# EAGLE design battery timer (EAGLE 6.5.0)
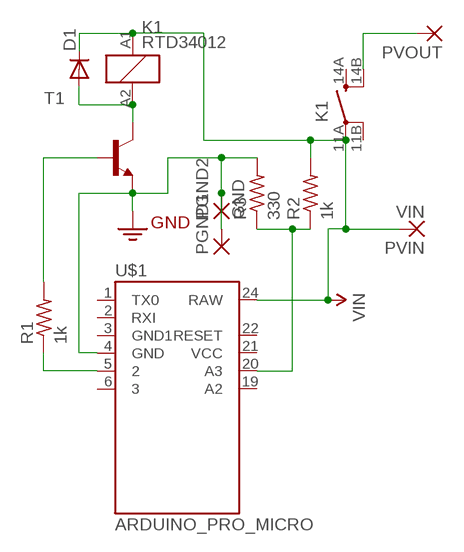
[diagram p0: schematic, sheet 1]

## Parts
D1  DIODE-DO-214AC  [DO-214AC]
K1  RTD34012  [RT-N/O16A5]
PGND1  SMD5  [SMD2,54-5,08]
PGND2  GND  SMD5  [SMD2,54-5,08]
PVIN  VIN  SMD5  [SMD2,54-5,08]
PVOUT  SMD5  [SMD2,54-5,08]
R1  1k  R-US_R1206  [R1206]
R2  1k  R-US_R1206  [R1206]
R3  330  R-US_R1206  [R1206]
T1  MMBT4401LT1-NPN-SOT23-BEC  [SOT23-BEC]
U$1  ARDUINO_PRO_MICRO  [ARDUINO_PRO_MICRO]

## Nets
3.3V: PGND1.1(P) PGND2.1(P) R3.2 T1.E U$1.4(GND) ; supply symbol labelled GND2
N$1: R2.1 R3.1 U$1.20(A3)
N$2: R1.1 U$1.5
N$3: D1.A K1.A2 T1.C
N$4: R1.2 T1.B
PVOUT [12v]: K1.14B(2:SB) PVOUT.1(P)
VIN: D1.C K1.11A(2:PA) K1.A1 PVIN.1(P) R2.2 U$1.24(RAW)
Unconnected: K1.11B(2:PB) K1.14A(2:SA) U$1.1(TX0) U$1.2(RXI) U$1.3(GND1) U$1.6 U$1.19(A2) U$1.21(VCC) U$1.22(RESET)

## Library data of the parts
D1 = diode:DIODE-: DIODE
K1 = relay:RTD3*: Power PCB Relay SCHRACK 1 pole 12 / 16 A, DC- or AC-coil Source: http://www.schrack.com/.. 5819.pdf; MF: TYCO ELECTRONICS; MPN: RTD34012F; OC_FARNELL: unknown; OC_NEWARK: 36K3470
PGND1 PGND2 PVIN PVOUT = wirepad:SMD5: SMD PAD
R1-R3 = resistor:R-US_: RESISTOR, American symbol
T1 = transistor:*-NPN-: NPN Transistror BF959 corrected 2008.03.06
U$1 = SparkFun-Boards:ARDUINO_PRO_MICRO

## Net classes
0 default: width 0.508 mm, drill 0.508 mm, clearance 0.508 mm
1 12v: width 2.54 mm, drill 2.54 mm, clearance 0.635 mm

## Board
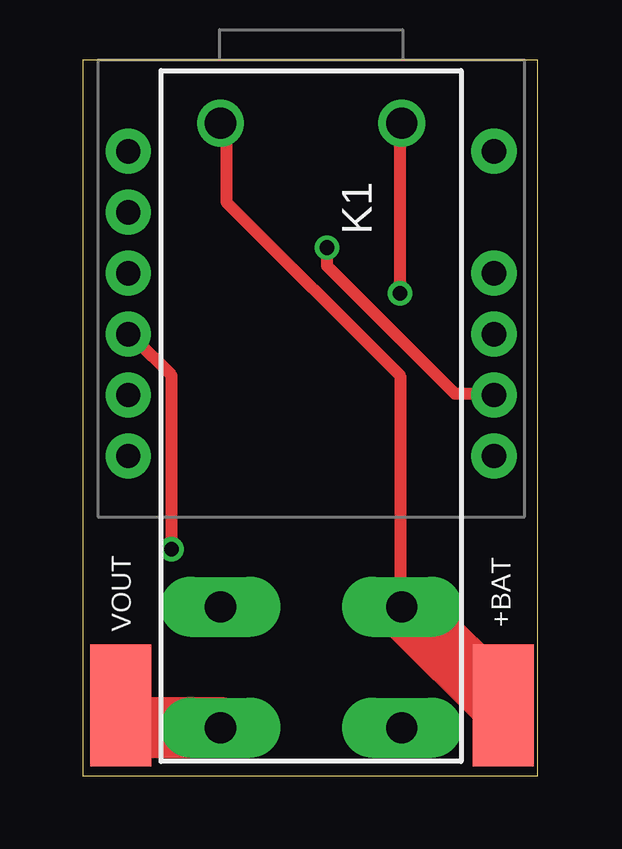
[diagram p1: board, top side]
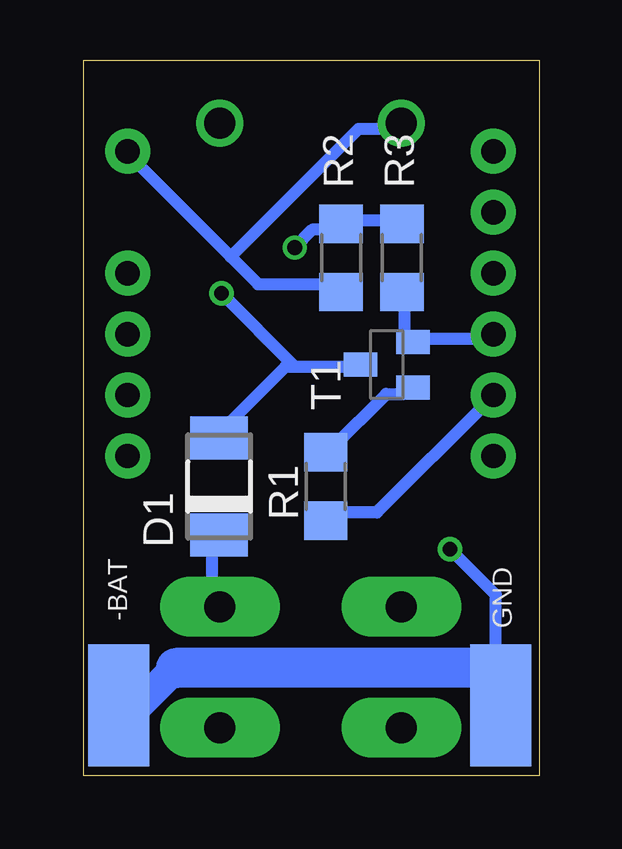
[diagram p2: board, bottom side, seen from below]

Size 18.97 x 29.84 mm. Coordinates in mm from the lower left corner, seen from the top.
Outline: 0,0 18.97,0 18.97,29.84 0,29.84 0,0
Copper layers (1*16): Top 0.035mm / dielectric 1.5mm / Bottom 0.035mm
Design rules "default": minimum track width 10mil, minimum drill 24mil, track to track 8mil, track to pad 8mil, pad to pad 8mil, via to via 8mil, smd to smd 8mil, copper to edge 40mil, drill to drill 8mil, minimum pad ring 10mil, minimum via ring 8mil, stop-mask expansion 4mil, vias tented up to drill 0mil, thermal gap 10mil

### Footprints (pad centres in the part's own frame; a part is rotated, then mirrored left to right if it is on the bottom)
DO-214AC = smd 1.8 x 2.4: A 2.025,0; C -2.025,0
RT-N/O16A5 = drill 1.3 pad 2.5 long: 11A 7.56,3.78; 11B 7.56,-3.78; 14A 12.6,3.78; 14B 12.6,-3.78 | drill 1.3: A1 -12.6,-3.78; A2 -12.6,3.78
SMD2,54-5,08 = smd 2.54 x 5.08: 1 0,0
R1206 = smd 1.6 x 1.803: 1 -1.422,0; 2 1.422,0
SOT23-BEC = smd 1 x 1.4: B -0.95,-1.1; C 0,1.1; E 0.95,-1.1
ARDUINO_PRO_MICRO = drill 1.016 pad 1.88: 1 -7.62,12.7; 2 -7.62,10.16; 3 -7.62,7.62; 4 -7.62,5.08; 5 -7.62,2.54; 6 -7.62,0; 19 7.62,0; 20 7.62,2.54; 21 7.62,5.08; 22 7.62,7.62; 24 7.62,12.7

### Placement (x,y rotation side)
D1  13.34,12.06 90 bottom
K1  9.53,14.61 270 top
PGND1  1.6,2.95 180 bottom
PGND2  17.53,2.95 0 bottom
PVIN  17.53,2.95 0 top
PVOUT  1.6,2.95 0 top
R1  8.89,12.06 90 bottom
R2  8.26,21.59 270 bottom
R3  5.71,21.59 270 bottom
T1  6.35,17.14 90 bottom
U$1  9.53,13.33 0 top

### Tracks (layer width: path | path; a pad name or v marks a point on that pad's centre or on a via)
3.3V  (via drill 0.61)
  Top 0.508: v3.71,9.45 3.71,16.69 2.18,18.21 U$1.4
  Bottom 0.508: R3.2 5.61,20.12 5.61,18.21 T1.E 5.23,18.21 2.18,18.21 U$1.4 | v3.71,9.45 1.8,7.54 1.8,4.5 PGND1.1 1.8,2.97 | 16.66,2.97 17.42,2.97 PGND2.1
  Bottom 1.27: 1.8,2.97 1.8,4.5 | 15.14,4.5 16.66,2.97
  Bottom 1.676: 1.8,4.5 15.14,4.5
N$1  (via drill 0.61)
  Top 0.508: v10.19,22.02 10.19,21.26 15.52,15.93 17.04,15.93 U$1.20
  Bottom 0.508: R3.1 5.99,23.16 7.9,23.16 R2.1 8.28,22.78 9.42,22.78 v10.19,22.02
N$2
  Bottom 0.508: R1.1 8.66,10.97 6.76,10.97 2.18,15.54 U$1.5
N$3  (via drill 0.61)
  Top 0.508: v13.23,20.12 13.23,26.97 K1.A2
  Bottom 0.508: 10.19,17.07 10.57,17.07 13.23,14.4 D1.A | 10.19,17.07 7.52,17.07 T1.C | 10.19,17.07 v13.23,20.12
N$4
  Bottom 0.508: T1.B 5.61,15.93 6.38,15.93 8.66,13.64 R1.2
PVOUT
  Top 0: 1.6,2 PVOUT.1
  Top 2.54: K1.14B 1.6,2
VIN
  Top 0.508: 17.42,2.97 PVIN.1 | 13.61,6.78 K1.11A 13.23,7.16 13.23,16.69 5.99,23.93 5.99,26.97 K1.A1
  Top 2.54: 13.61,6.78 17.42,2.97
  Bottom 0.508: D1.C 13.61,9.83 13.61,7.16 K1.11A | 12.85,21.64 17.04,25.83 U$1.24 | 12.85,21.64 11.71,20.5 8.28,20.5 R2.2 | 12.85,21.64 7.52,26.97 5.99,26.97 K1.A1

### Text on the board
tPlace: VOUT | +BAT
bPlace: GND | -BAT